# Altium schematic sheet Serial_Led.SchDoc
size A4
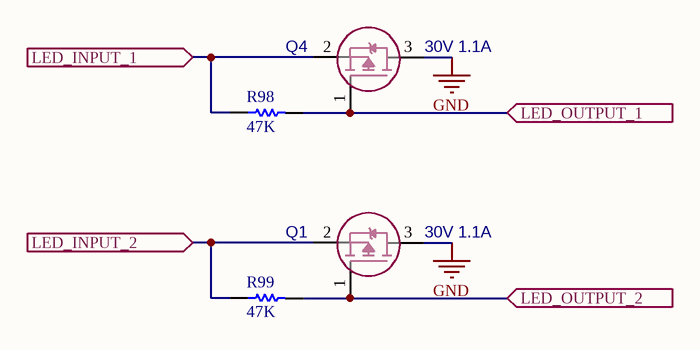
[diagram p0: Serial_Led.SchDoc]

## Parts
Q1  value 30V 1.1A  [SOT23]  (hidden comment: PJA3433_R1_00001)
Q4  value 30V 1.1A  [SOT23]  (hidden comment: PJA3433_R1_00001)
R98  value 47K  [RES_0603]  (hidden comment: RES)
R99  value 47K  [RES_0603]  (hidden comment: RES)

## Ports
LED_INPUT_1 (in), LED_INPUT_2 (in), LED_OUTPUT_1 (in), LED_OUTPUT_2 (in)

## Nets
GND: Q1.3(D) Q4.3(D)
LED_INPUT_1: Q4.2(S) R98.1 ; port LED_INPUT_1
LED_INPUT_2: Q1.2(S) R99.1 ; port LED_INPUT_2
LED_OUTPUT_1: Q4.1(G) R98.2 ; port LED_OUTPUT_1
LED_OUTPUT_2: Q1.1(G) R99.2 ; port LED_OUTPUT_2

## Notes on the sheet
- Title
- Size:
- Date:
- A4
- Number:
- Time:
- Revision:
- Sheet
- of
- Drawn by:

## Library data of the parts
Q1 Q4 = PMV65XPVL: MOSFET DIS.1.1A 30V P-CH SOT23 SMT; Manufacturer: PANJIT; Package: SOT-23; Manufacturer Part Number: PJA3433_R1_00001
R98 R99 = R03000: RES 0603 47K Ohms 1% 1/10W-S 100PPM; Manufacturer: ROYALOHM; Manufacturer Part Number: 0603SAF4702T5E